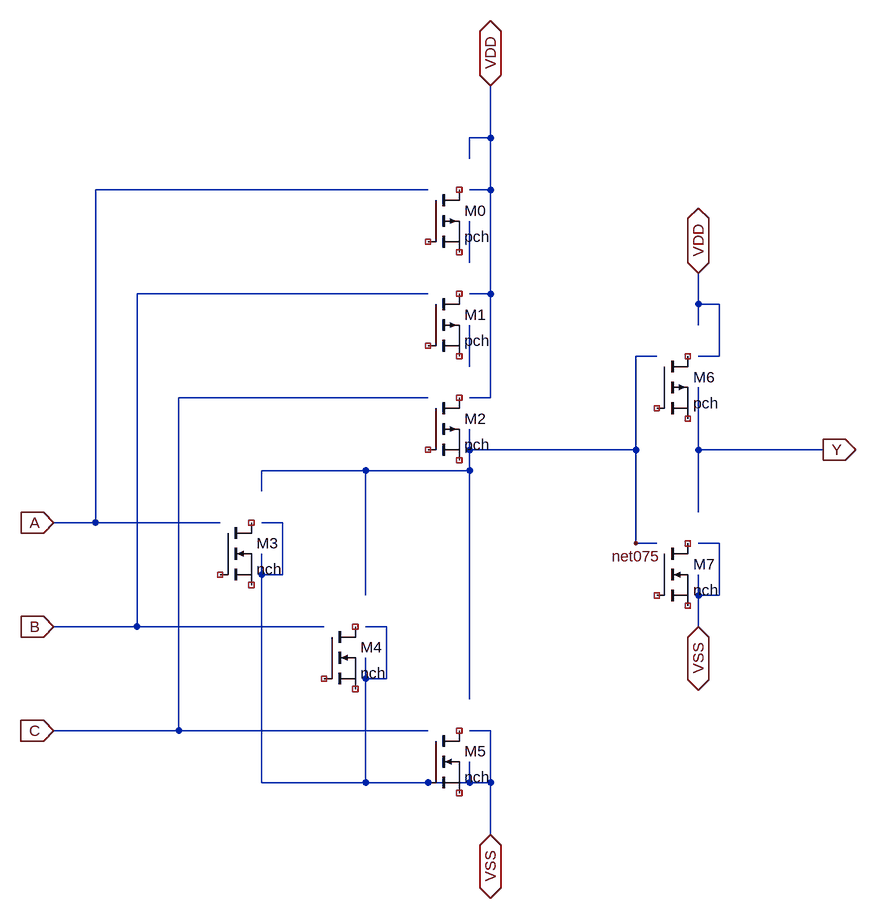
[diagram p0: schematic or31.asc]
or31.asc, the LTspice schematic file:
Version 4
SHEET 1 1360 1344
WIRE 224 928 224 416
WIRE 224 928 512 928
WIRE 224 416 672 416
WIRE 96 928 224 928
WIRE 160 256 672 256
WIRE 160 768 160 256
WIRE 160 768 352 768
WIRE 96 768 160 768
WIRE 736 368 736 304
WIRE 1088 752 1088 656
WIRE 1088 656 1088 560
WIRE 1088 656 1280 656
WIRE 1088 928 1088 880
WIRE 1088 800 1120 800
WIRE 1120 880 1120 800
WIRE 1088 880 1088 848
WIRE 1088 880 1120 880
WIRE 768 1248 768 1168
WIRE 576 1168 576 1008
WIRE 576 1168 736 1168
WIRE 416 1168 576 1168
WIRE 416 1168 416 848
WIRE 416 768 448 768
WIRE 448 848 448 768
WIRE 416 848 448 848
WIRE 736 1168 736 1136
WIRE 736 1168 768 1168
WIRE 416 848 416 816
WIRE 768 1168 768 1088
WIRE 736 1088 768 1088
WIRE 576 1008 576 976
WIRE 576 1008 608 1008
WIRE 608 1008 608 928
WIRE 576 928 608 928
WIRE 992 800 1024 800
WIRE 992 800 992 656
WIRE 992 512 1024 512
WIRE 992 656 992 512
WIRE 736 656 992 656
WIRE 736 688 736 656
WIRE 736 656 736 624
WIRE 576 880 576 688
WIRE 576 688 736 688
WIRE 736 1040 736 688
WIRE 416 688 576 688
WIRE 416 720 416 688
WIRE 288 576 672 576
WIRE 288 1088 288 576
WIRE 288 1088 672 1088
WIRE 96 1088 288 1088
WIRE 736 528 736 464
WIRE 1088 464 1088 432
WIRE 1088 432 1088 384
WIRE 1088 432 1120 432
WIRE 1120 512 1120 432
WIRE 1088 512 1120 512
WIRE 768 176 768 96
WIRE 736 416 768 416
WIRE 768 416 768 256
WIRE 736 256 768 256
WIRE 768 256 768 176
WIRE 736 208 736 176
WIRE 736 176 768 176
WIRE 768 576 768 416
WIRE 736 576 768 576
FLAG 992 800 net075
SYMBOL NMOS 1024 800 R0
SYMATTR InstName M7
SYMATTR Value nch
SYMATTR Value2 w=2u l=1u
SYMBOL NMOS 672 1088 R0
SYMATTR InstName M5
SYMATTR Value nch
SYMATTR Value2 w=2u l=1u
SYMBOL NMOS 512 928 R0
SYMATTR InstName M4
SYMATTR Value nch
SYMATTR Value2 w=2u l=1u
SYMBOL NMOS 352 768 R0
SYMATTR InstName M3
SYMATTR Value nch
SYMATTR Value2 w=2u l=1u
SYMBOL PMOS 1024 512 R0
SYMATTR InstName M6
SYMATTR Value pch
SYMATTR Value2 w=6u l=1u
SYMBOL PMOS 672 576 R0
SYMATTR InstName M2
SYMATTR Value pch
SYMATTR Value2 w=12.6u l=1u
SYMBOL PMOS 672 416 R0
SYMATTR InstName M1
SYMATTR Value pch
SYMATTR Value2 w=12.6u l=1u
SYMBOL PMOS 672 256 R0
SYMATTR InstName M0
SYMATTR Value pch
SYMATTR Value2 w=12.6u l=1u
FLAG 1280 656 Y
IOPIN 1280 656 Out
FLAG 1088 928 VSS
IOPIN 1088 928 BiDir
FLAG 1088 384 VDD
IOPIN 1088 384 BiDir
FLAG 768 1248 VSS
IOPIN 768 1248 BiDir
FLAG 768 96 VDD
IOPIN 768 96 BiDir
FLAG 96 1088 C
IOPIN 96 1088 In
FLAG 96 928 B
IOPIN 96 928 In
FLAG 96 768 A
IOPIN 96 768 In

The netlist it stands for:
* or31.asc
* M7: nch w=2u l=1u (symbol NMOS not certain, pin order unknown); nets seen at it: 
* M5: nch w=2u l=1u (symbol NMOS not certain, pin order unknown); nets seen at it: VSS
* M4: nch w=2u l=1u (symbol NMOS not certain, pin order unknown); nets seen at it: 
* M3: nch w=2u l=1u (symbol NMOS not certain, pin order unknown); nets seen at it: 
* M6: pch w=6u l=1u (symbol PMOS not certain, pin order unknown); nets seen at it: 
* M2: pch w=12.6u l=1u (symbol PMOS not certain, pin order unknown); nets seen at it: 
* M1: pch w=12.6u l=1u (symbol PMOS not certain, pin order unknown); nets seen at it: 
* M0: pch w=12.6u l=1u (symbol PMOS not certain, pin order unknown); nets seen at it: 
.backanno
.end